# Altium schematic sheet FBA_Sch.SchDoc: FBA
size A4; Author: Zixi Chen; DocumentNumber: 1; Revision: 1; SheetNumber: 1; SheetTotal: 1
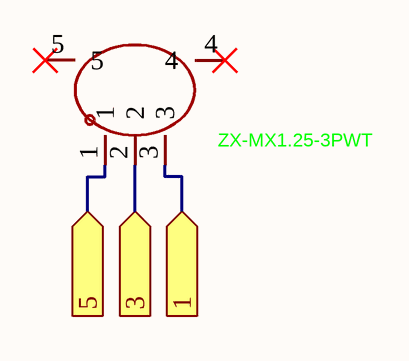
[diagram p0: FBA_Sch.SchDoc]

## Parts
U1  ZX-MX1.25-3PWT  [CONN-SMD_3P-P1.25_MEGASTAR_ZX-MX1.25-3PWT]

## Ports
1 (in), 3 (in), 5 (in)

## Nets
1: U1.3 ; port 1
3: U1.2 ; port 3
5: U1.1 ; port 5

Not connected (* = marked no-connect by the designer): U1 4* 5*

## Library data of the parts
U1 = CMP-010-000000-1: Manufacturer: Megastar(兆星); Pins Structure: 1x3P; Voltage Rating: 125V; Y-Width of Bottom Edge on Board: 5.25mm; Add into BOM: yes; Current Rating: 1A; Reference Series: PicoBlade(MX 1.25); Plastic Material: LCP; Pitch: 1.25mm; Z-Height of the Board: 3.6mm; X-Length of Bottom Edge on Board (Spacing Line): 8.75mm; Number of PINs Per Row: 3; Supplementary Features: Auxiliary Solder Pin; Color: Beige; Symbol: ZX-MX1.25-3PWT; Flame Retardant Rating: -; Operating Temperature: -25℃~+85℃; JLCPCB Part Class: Extended Part; Row Spacing: -; Number of Pins: 3P; Mounting Type: Surface Mount, Right Angle; Datasheet: https://item.szlcsc.com/datasheet/ZX-MX1.25-3PWT/8430338.html; Contact Plating: Tin; Device: ZX-MX1.25-3PWT; Manufacturer Part: ZX-MX1.25-3PWT; Convert to PCB: yes; Number of Rows: 1; Supplier Footprint: SMD,P=1.25mm,卧贴; Source: FBA.SchLib; LCSC Part Name: 1x3P 间距:1.25mm 卧贴 系列:PicoBlade(MX 1.25); Contact Material: Brass; Design Item ID: ZX-MX1.25-3PWT; Supplier Part: C7430469